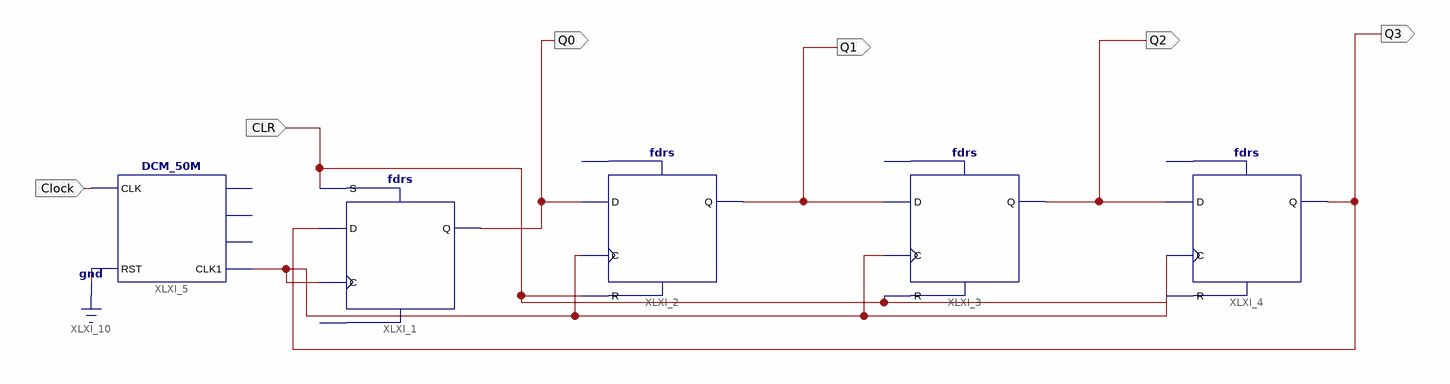
[diagram p0: schematic sheet 1]
// Xilinx ISE schematic lab7_experiment8.sch (spartan3e) as structural Verilog: 5 symbols, 6 ports
module lab7_experiment8 (
  input  Clock,
  input  CLR,
  output Q3,
  output Q0,
  output Q1,
  output Q2
);

  wire XLXN_18;

  DCM_50M XLXI_5 (.CLK(Clock), .RST(1'b0), .CLK1(XLXN_18));  // open: CLK1M, CLK10k, CLK1k
  fdrs XLXI_1 (.C(XLXN_18), .D(Q3), .S(CLR), .Q(Q0));  // open: R
  fdrs XLXI_2 (.C(XLXN_18), .D(Q0), .R(CLR), .Q(Q1));  // open: S
  fdrs XLXI_3 (.C(XLXN_18), .D(Q1), .R(CLR), .Q(Q2));  // open: S
  fdrs XLXI_4 (.C(XLXN_18), .D(Q2), .R(CLR), .Q(Q3));  // open: S
endmodule
